# Altium schematic sheet FULLL.SchDoc
size A; SheetNumber: 1; SheetTotal: 5
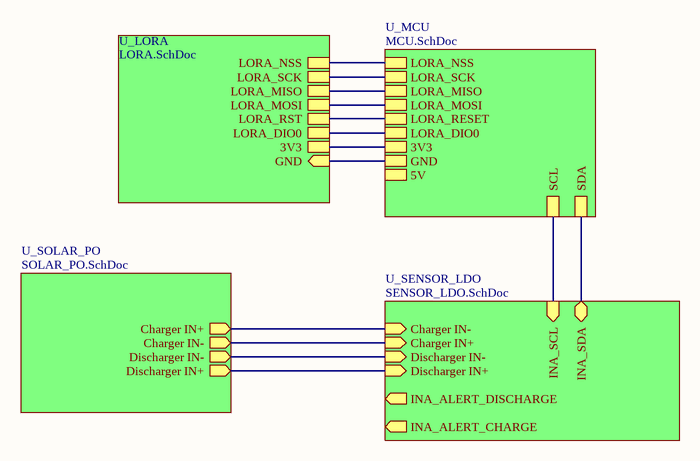
[diagram p0: FULLL.SchDoc]

## Sub-sheets
U_LORA = LORA.SchDoc: GND (in), 3V3, LORA_NSS, LORA_MOSI, LORA_MISO, LORA_SCK, LORA_RST, LORA_DIO0
U_MCU = MCU.SchDoc: LORA_NSS, LORA_SCK, LORA_MISO, LORA_MOSI, LORA_RESET, LORA_DIO0, 3V3, GND, 5V, SDA, SCL
U_SENSOR_LDO = SENSOR_LDO.SchDoc: INA_ALERT_CHARGE (out), INA_ALERT_DISCHARGE (out), INA_SDA (bidir), INA_SCL (in), Discharger IN- (in), Discharger IN+ (in), Charger IN+ (in), Charger IN- (in)
U_SOLAR_PO = SOLAR_PO.SchDoc: Charger IN+ (out), Charger IN- (out), Discharger IN- (out), Discharger IN+ (out)

## Nets
(unnamed): sheet U_LORA/GND, sheet U_MCU/GND
(unnamed): sheet U_LORA/3V3, sheet U_MCU/3V3
(unnamed): sheet U_LORA/LORA_NSS, sheet U_MCU/LORA_NSS
(unnamed): sheet U_LORA/LORA_MOSI, sheet U_MCU/LORA_MOSI
(unnamed): sheet U_LORA/LORA_MISO, sheet U_MCU/LORA_MISO
(unnamed): sheet U_LORA/LORA_SCK, sheet U_MCU/LORA_SCK
(unnamed): sheet U_LORA/LORA_RST, sheet U_MCU/LORA_RESET
(unnamed): sheet U_LORA/LORA_DIO0, sheet U_MCU/LORA_DIO0
(unnamed): sheet U_SOLAR_PO/Charger IN+, sheet U_SENSOR_LDO/Charger IN-
(unnamed): sheet U_SOLAR_PO/Charger IN-, sheet U_SENSOR_LDO/Charger IN+
(unnamed): sheet U_SOLAR_PO/Discharger IN-, sheet U_SENSOR_LDO/Discharger IN-
(unnamed): sheet U_SOLAR_PO/Discharger IN+, sheet U_SENSOR_LDO/Discharger IN+
(unnamed): sheet U_MCU/SDA, sheet U_SENSOR_LDO/INA_SDA
(unnamed): sheet U_MCU/SCL, sheet U_SENSOR_LDO/INA_SCL